# EAGLE design hbridge (EAGLE 5.10)
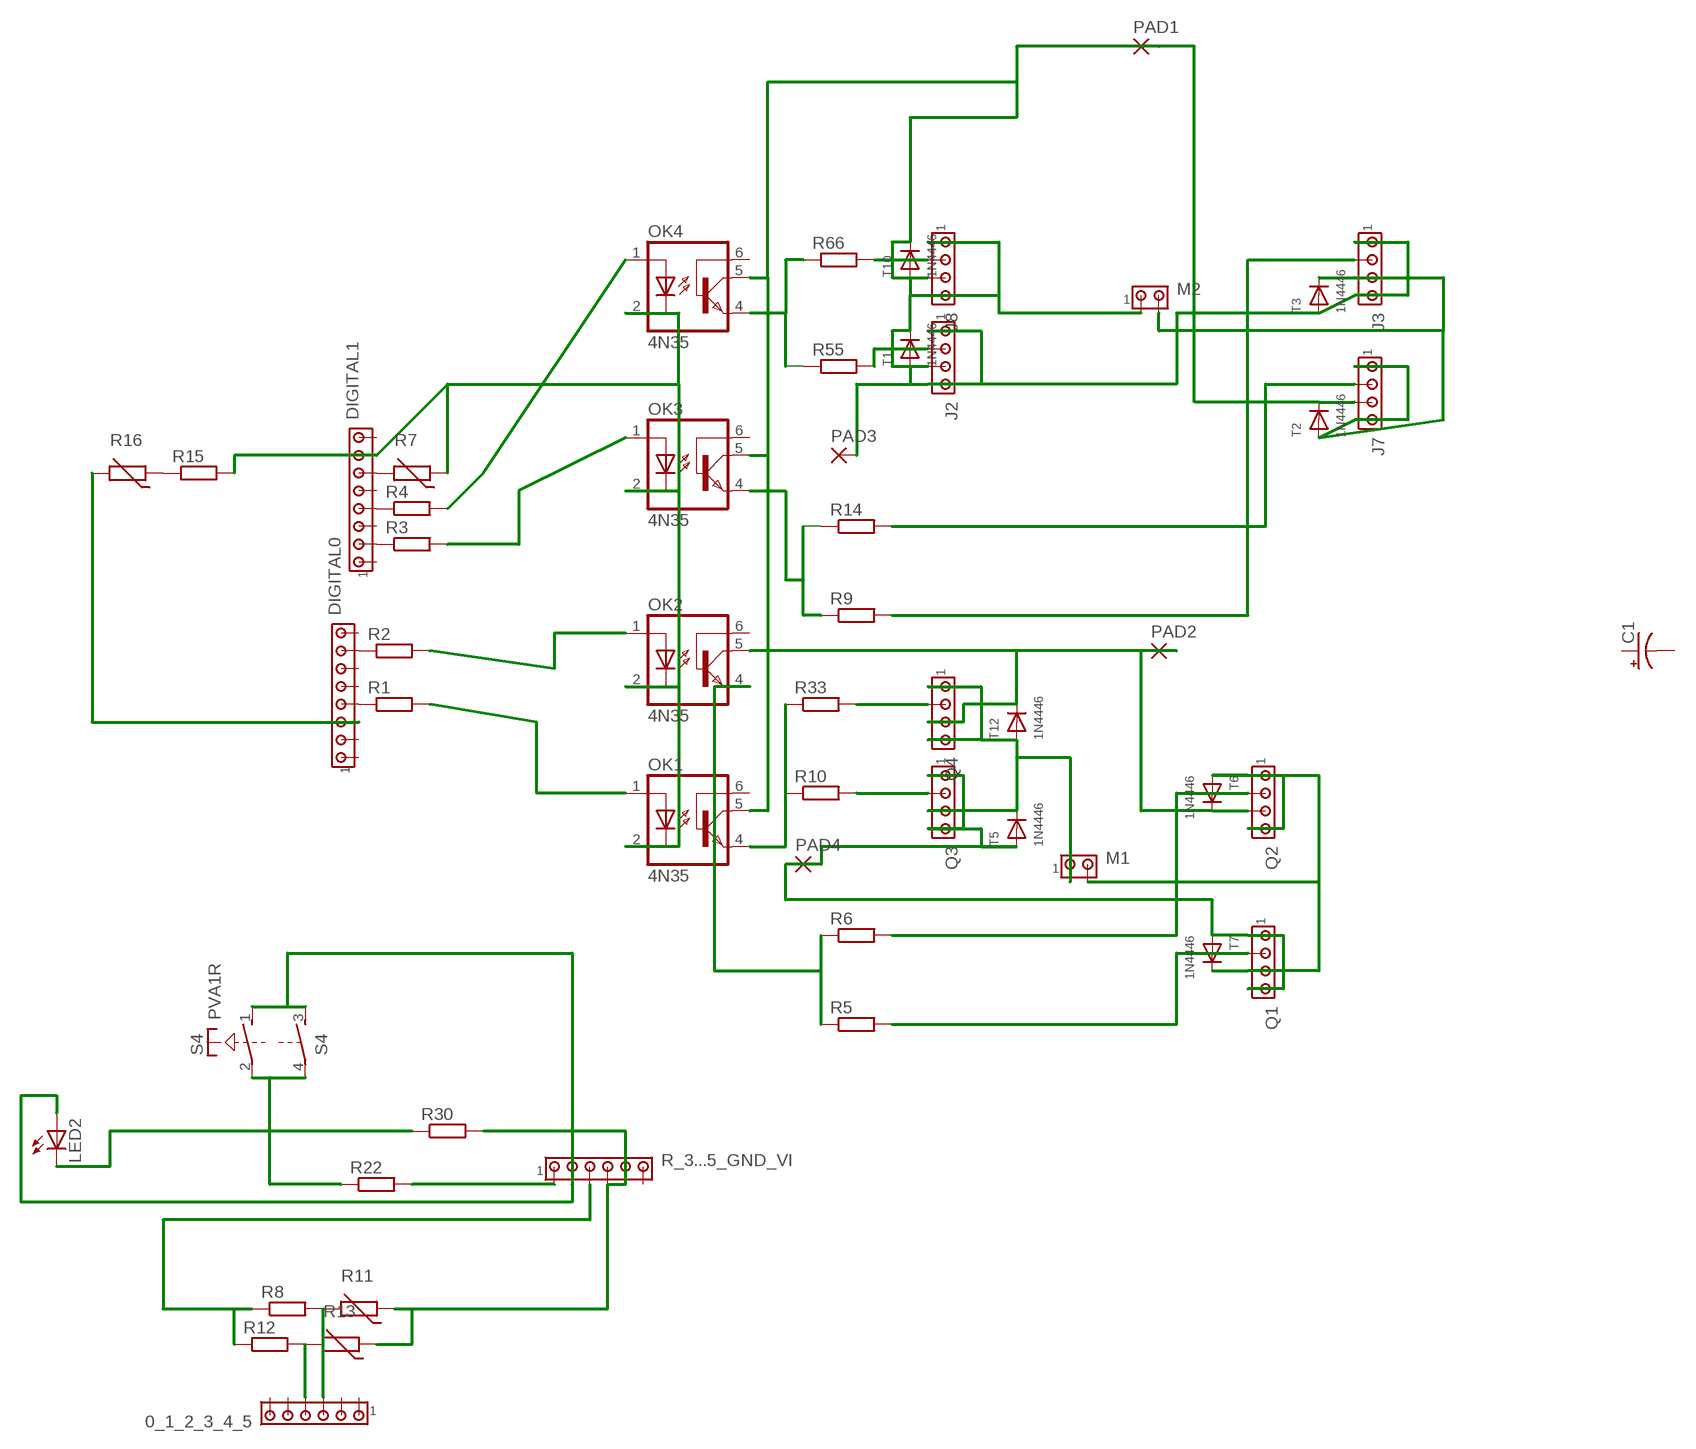
[diagram p0: schematic, sheet 1]

## Parts
0_1_2_3_4_5  MTA06-100  [10X06MTA]
C1  CPOL-USE5-6  [E5-6]
DIGITAL0  MTA08-100  [10X08MTA]
DIGITAL1  MTA08-100  [10X08MTA]
J2  MTA04-100  [10X04MTA]
J3  MTA04-100  [10X04MTA]
J7  MTA04-100  [10X04MTA]
J8  MTA04-100  [10X04MTA]
LED2  LED3MM  [LED3MM]
M1  MTA02-156  [1X2MTA]
M2  MTA02-156  [1X2MTA]
OK1  4N35  [DIL06]
OK2  4N35  [DIL06]
OK3  4N35  [DIL06]
OK4  4N35  [DIL06]
PAD1  2,54/0,8  [2,54/0,8]
PAD2  2,54/0,8  [2,54/0,8]
PAD3  2,54/0,8  [2,54/0,8]
PAD4  2,54/0,8  [2,54/0,8]
Q1  MTA04-100  [10X04MTA]
Q2  MTA04-100  [10X04MTA]
Q3  MTA04-100  [10X04MTA]
Q4  MTA04-100  [10X04MTA]
R1  R-EU_0207/7  [0207/7]
R2  R-EU_0207/7  [0207/7]
R3  R-EU_0207/7  [0207/7]
R4  R-EU_0207/7  [0207/7]
R5  R-EU_0207/7  [0207/7]
R6  R-EU_0207/7  [0207/7]
R7  THERMISTOR-2,5  [RS-2,5]
R8  R-EU_0207/7  [0207/7]
R9  R-EU_0207/7  [0207/7]
R10  R-EU_0207/7  [0207/7]
R11  THERMISTOR-2,5  [RS-2,5]
R12  R-EU_0207/7  [0207/7]
R13  THERMISTOR-2,5  [RS-2,5]
R14  R-EU_0207/7  [0207/7]
R15  R-EU_0207/7  [0207/7]
R16  THERMISTOR-2,5  [RS-2,5]
R22  R-EU_0207/7  [0207/7]
R30  R-EU_0207/7  [0207/7]
R33  R-EU_0207/7  [0207/7]
R55  R-EU_0207/7  [0207/7]
R66  R-EU_0207/7  [0207/7]
R_3...5_GND_VI  MTA06-100  [10X06MTA]
S4  PVA1R  [PVA1R]
T1  1N4446  DIODEDO-1N4148  [DO-1N4148]
T2  1N4446  DIODEDO-1N4148  [DO-1N4148]
T3  1N4446  DIODEDO-1N4148  [DO-1N4148]
T5  1N4446  DIODEDO-1N4148  [DO-1N4148]
T6  1N4446  DIODEDO-1N4148  [DO-1N4148]
T7  1N4446  DIODEDO-1N4148  [DO-1N4148]
T10  1N4446  DIODEDO-1N4148  [DO-1N4148]
T12  1N4446  DIODEDO-1N4148  [DO-1N4148]

## Nets
APWD: R8.1 R12.1 R_3...5_GND_VI.4
N$1: LED2.K(C) R30.1
N$3: 0_1_2_3_4_5.4 R8.2 R11.2
N$4: R15.1 R16.1
N$5: DIGITAL1.7 OK1.2(C) OK2.2(C) OK3.2(C) OK4.2(C) R7.1 R15.2
N$6: OK3.1(A) R3.2
N$7: OK4.1(A) R4.2
N$8: OK2.4(EMI) R5.1 R6.1
N$9: OK2.1(A) R2.2
N$10: R22.1 S4.2(1:P) S4.4(2:P)
N$11: DIGITAL0.4 R1.1
N$12: OK1.1(A) R1.2
N$13: J3.2 R9.2
N$14: OK1.4(EMI) R10.1 R33.1
N$15: DIGITAL0.7 R2.1
N$16: DIGITAL1.2 R3.1
N$17: DIGITAL1.4 R4.1
N$18: J8.2 R66.2
N$19: DIGITAL1.6 R7.2
N$20: J2.3 J8.1 J8.4 M2.1 T1.C T10.A
N$21: PAD4.1(P) Q1.1 Q1.4 Q3.1 Q3.4 T5.A T7.A
N$22: OK3.4(EMI) R9.1 R14.1
N$23: R22.2 R_3...5_GND_VI.6
N$24: OK4.4(EMI) R55.1 R66.1
N$25: J2.2 R55.2
N$26: 0_1_2_3_4_5.3 R12.2 R13.2
N$27: M1.2 Q1.3 Q2.1 Q2.4 T6.A T7.C
N$28: DIGITAL0.3 R16.2
N$29: J7.2 R14.2
N$31: Q2.2 R6.2
N$32: Q3.2 R10.2
N$33: R11.1 R13.1 R30.2 R_3...5_GND_VI.2 R_3...5_GND_VI.3
N$34: M1.1 Q3.3 Q4.1 Q4.4 T5.C T12.A
N$35: Q1.2 R5.2
N$36: Q4.2 R33.2
N$37: J2.1 J2.4 J3.1 J3.4 PAD3.1(P) T1.A T3.A
N$39: J7.3 J8.3 OK1.5(COL) OK2.5(COL) OK3.5(COL) OK4.5(COL) PAD1.1(P) PAD2.1(P) Q2.3 Q4.3 T2.C T6.C T10.C T12.C
N$41: J3.3 J7.1 J7.4 M2.2 T2.A T3.C
N$72: LED2.A R_3...5_GND_VI.5 S4.1(1:S) S4.3(2:S)
Unconnected: 0_1_2_3_4_5.1 0_1_2_3_4_5.2 0_1_2_3_4_5.5 0_1_2_3_4_5.6 C1.+ C1.- DIGITAL0.1 DIGITAL0.2 DIGITAL0.5 DIGITAL0.6 DIGITAL0.8 DIGITAL1.1 DIGITAL1.3 DIGITAL1.5 DIGITAL1.8 OK1.6(BAS) OK2.6(BAS) OK3.6(BAS) OK4.6(BAS) R_3...5_GND_VI.1

## Library data of the parts
0_1_2_3_4_5 R_3...5_GND_VI = con-amp:MTA06-100: AMP connector
C1 = rcl:CPOL-US: POLARIZED CAPACITOR, American symbol
DIGITAL0 DIGITAL1 = con-amp:MTA08-100: AMP connector
J2 J3 J7 J8 Q1-Q4 = con-amp:MTA04-100: AMP connector
LED2 = adafruit:LED: LED OSRAM: - CHIPLED LG R971, LG N971, LY N971, LG Q971, LY Q971, LO R971, LY R971 LH N974, LH R974 LS Q976, LO Q976, LY Q976 LO Q996 - Hyper CHIPLED LW Q18S LB Q993, LB Q99A, LB R99A - SideLED LS A670, LO A670, LY A670, LG A670, LP A670 LB A673, LV A673, LT A673, LW A673 LH A674 LY A675 LS A676, LA A676, LO A676, LY A676, LW A676 LS A679, LY A679, LG A679 - Hyper Micro SIDELED® LS Y876, LA Y876, LO Y876, LY Y876 LT Y87S - SmartLED LW L88C, LW L88S LB L89C, LB L89S, LG L890 LS L89K, LO L89K, LY L89K LS L896, LA L896, LO L896, LY L896 - TOPLED LS T670, LO T670, LY T670, LG T670, LP T670 LSG T670, LSP T670, LSY T670, LOP T670, LYG T670 LG T671, LOG T671, LSG T671 LB T673, LV T673, LT T673, LW T673 LH T674 LS T676, LA T676, LO T676, LY T676, LB T676, LH T676, LSB T676, LW T676 LB T67C, LV T67C, LT T67C, LS T67K, LO T67K, LY T67K, LW E67C LS E67B, LA E67B, LO E67B, LY E67B, LB E67C, LV E67C, LT E67C LW T67C LS T679, LY T679, LG T679 LS T770, LO T770, LY T770, LG T770, LP T770 LB T773, LV T773, LT T773, LW T773 LH T774 LS E675, LA E675, LY E675, LS T675 LS T776, LA T776, LO T776, LY T776, LB T776 LHGB T686 LT T68C, LB T68C - Hyper Mini TOPLED® LB M676 - Mini TOPLED Santana® LG M470 LS M47K, LO M47K, LY M47K Source: http://www.osram.convergy.de/
M1 M2 = con-amp:MTA02-156: AMP connector
OK1-OK4 = optocouplerxxx:4N35: MOTOROLA OPTO COUPLER
PAD1-PAD4 = wirepad:2,54/0,8: THROUGH-HOLE PAD
R1-R6 R8-R10 R12 R14 R15 R22 R30 R33 R55 R66 = resistor:R-EU_: RESISTOR, European symbol
R7 R11 R13 R16 = varistor:THERMISTOR: THERMISTOR
S4 = switch-misc:PVA1R: ITT SWITCH
T1-T3 T5-T7 T10 T12 = adafruit:DIODE: Diode SMADIODE - SMA Surface Mount Package 20V 1A Schottky Diode Digikey: 641-1014-6-ND DO-1N4148 - Through Hole Small Current Diode SOD-123 20V 1 A (.5mV Vf) Schottky Diode - Digikey: MBRX120TPMSCT-ND SOD-323 10V 570mA (.38mV Vf, 3ns) Schottky Diode - Digikey: ZLLS410CT-ND SOD-523 30V 30mA Schottky Diode (RB751S-40TE61) - Digikey: RB751S-40TE61CT-ND SOT23-R/W - SOT23 Package (R = Solder Paste/Reflow Ovens, W = Hand-Soldering) BAT54Film 40V 300mA - Digikey: 497-7162-1-ND

## Board
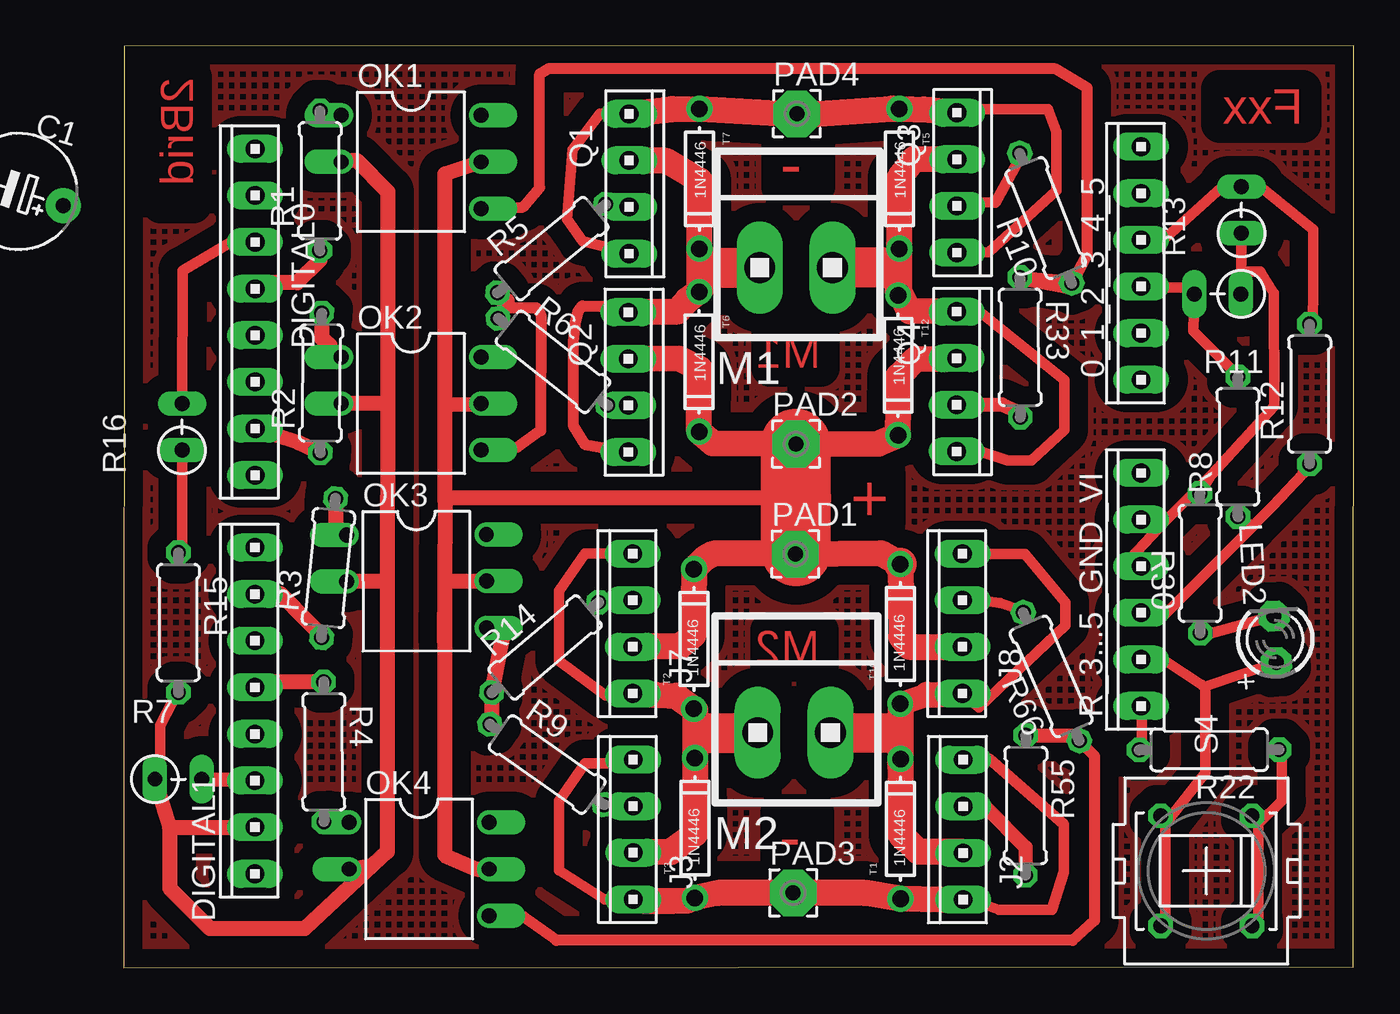
[diagram p1: board, top side]

Size 67.01 x 50.23 mm. Coordinates in mm from the lower left corner, seen from the top.
Outline: 67.01,50.23 0.03,50.21 0,0 66.99,0.05 67.01,50.23
Copper layers (1*16): Top 0.035mm / dielectric 1.5mm / Bottom 0.035mm
Design rules "default *": minimum track width 23mil, minimum drill 24mil, track to track 40mil, track to pad 35mil, pad to pad 28mil, via to via 35mil, smd to smd 25mil, copper to edge 40mil, drill to drill 8mil, minimum pad ring 10mil, minimum via ring 30mil, stop-mask expansion 20mil, vias tented up to drill 0mil, thermal gap 1mil

### Footprints (pad centres in the part's own frame; a part is rotated, then mirrored left to right if it is on the bottom)
10X06MTA = drill 1.016 long: 1 6.35,0; 2 3.81,0; 3 1.27,0; 4 -1.27,0; 5 -3.81,0; 6 -6.35,0
E5-6 = drill 0.813 pad 1.905 round: + -2.54,0 | drill 0.813 pad 1.905 octagon: - 2.54,0
10X08MTA = drill 1.016 long: 1 8.89,0; 2 6.35,0; 3 3.81,0; 4 1.27,0; 5 -1.27,0; 6 -3.81,0; 7 -6.35,0; 8 -8.89,0
10X04MTA = drill 1.016 long: 1 3.81,0; 2 1.27,0; 3 -1.27,0; 4 -3.81,0
LED3MM = drill 0.813 pad 1.676 octagon: A -1.27,0; K 1.27,0
1X2MTA = drill 1.676 long: 1 1.981,0; 2 -1.981,0
DIL06 = drill 0.813 offset: 1 -2.54,-3.81; 2 0,-3.81; 4 2.54,3.81; 5 0,3.81; 6 -2.54,3.81
2,54/0,8 = drill 0.813 pad 2.54 octagon: 1 0,0
0207/7 = drill 0.813 octagon: 1 -3.81,0; 2 3.81,0
RS-2,5 = drill 0.813 long: 1 -1.27,0; 2 1.27,0
PVA1R = drill 0.813 octagon: 1 -2.997,2.489; 2 -2.997,-2.489; 3 2.997,2.489; 4 2.997,-2.489
DO-1N4148 = drill 0.9 round: A -3.81,0; C 3.81,0

### Placement (x,y rotation side)
0_1_2_3_4_5  55.44,38.39 90 top
C1  -5.7,42.29 162.6 top  (outside the outline)
DIGITAL0  7.17,35.73 90 top
DIGITAL1  7.16,14.01 90 top
J2  45.74,7.53 90 top
J3  27.76,7.54 90 top
J7  27.74,18.76 90 top
J8  45.7,18.76 90 top
LED2  62.74,17.9 93.1 top
M1  36.64,38.15 0 top
M2  36.53,12.81 0 top
OK1  15.66,43.91 270 top
OK2  15.66,30.74 270 top
OK3  15.96,21.06 270.1 top
OK4  16.1,5.38 270 top
PAD1  36.6,22.54 0 top
PAD2  36.63,28.54 0 top
PAD3  36.48,4.08 0 top
PAD4  36.68,46.53 0 top
Q1  27.54,42.72 270 top
Q2  27.5,31.91 270 top
Q3  45.4,42.78 270 top
Q4  45.39,31.94 270 top
R1  10.7,42.88 89.9 top
R2  10.76,31.86 89.4 top
R3  11.17,21.78 84.3 top
R4  10.91,11.77 270.1 top
R5  23.32,39.19 39.3 top
R6  23.39,33.02 321.6 top
R7  2.98,10.28 0 top
R8  60.71,28.39 90 top
R9  23.07,11.08 324.9 top
R10  50.24,40.84 111.8 top
R11  59.6,36.71 180 top
R12  64.61,31.26 90 top
R13  60.9,41.29 90 top
R14  22.97,17.46 40.2 top
R15  2.99,18.81 270 top
R16  3.19,29.47 90 top
R22  59.14,11.88 180.1 top
R30  58.65,22.04 90.1 top
R33  48.84,33.81 270.2 top
R55  49.14,8.85 269.9 top
R66  50.54,15.87 113.6 top
R_3...5_GND_VI  55.44,20.61 90 top
S4  58.99,5.28 90 top
T1  42.33,7.57 90 top
T2  31.07,17.92 90 top
T3  31.13,7.62 90 top
T5  42.26,42.99 270 top
T6  31.36,33.02 270 top
T7  31.37,42.99 270 top
T10  42.31,18.19 90 top
T12  42.2,32.83 270 top

### Tracks (layer width: path | path; a pad name or v marks a point on that pad's centre or on a via)
APWD
  Top 0.584: 60.56,23.08 56.75,19.27 55.48,19.27 R_3...5_GND_VI.4 | 60.56,23.08 61.5,24.04 60.73,24.6 R8.1 | 60.56,23.08 62.58,25.14 64.67,27.37 64.25,26.98 R12.1
N$1
  Top 0.584: R30.1 58.68,18.21 59.01,18.16 LED2.K
N$2
  pour Top (hatched): 0.18,50.04 66.89,50.1 66.89,0.34 0.24,0.41
N$3
  Top 0.584: 0_1_2_3_4_5.4 55.48,37.05 56.75,37.05 57.01,37.06 58.31,37.06 R11.2 58.28,34.7 60.59,32.38 R8.2
N$4
  Top 0.584: R15.1 3.2,23.09 3.2,28.16 R16.1
N$5
  Top 0.584: R15.2 2.98,15.1 2.01,13.22 2.01,10.28 R7.1
  Top 0.813: DIGITAL1.7 2.51,7.66 R7.1 2.54,7.63 2.54,4.31 4.72,2.13 9.88,2.13 13.56,5.59 OK4.2 12.41,5.26 13.21,5.26 14.36,6.31 14.36,20.83 | OK3.2 14.34,21.06 14.36,20.83 | 14.37,30.73 OK2.2 | 14.38,30.72 14.37,30.73 | 14.38,30.72 14.36,20.83 | OK1.2 12.7,43.99 14.39,42.3 14.38,30.72 | 14.38,30.72 14.38,30.69 14.37,30.73
N$6
  Top 0.813: R3.2 11.55,24.14 OK3.1
N$7
  Top 0.813: OK4.1 10.96,7.92 R4.2
N$8
  Top 0.61: OK2.4 21.44,28.36 22.73,29.27 22.74,35.57 22.48,35.96 21.13,35.96 R5.1
  Top 0.813: 20.92,36.33 R5.1 20.92,36.3 R6.1
N$9
  Top 0.813: R2.2 10.78,34.31 11.24,33.94 11.08,33.61 OK2.1
N$10
  Top 0.584: 61.83,7.84 61.83,2.76 S4.2 | 61.83,7.84 63.1,9.11 63.1,11.65 R22.1 | 61.83,7.84 S4.4
N$11
  Top 0.813: R1.1 10.69,38.54 9.47,37.32 7.49,37.32 DIGITAL0.4
N$12
  Top 0.813: R1.2 11.8,46.49 OK1.1
N$13
  Top 0.813: R9.2 26.7,8.84 26.64,8.72 27.54,8.72 J3.2
N$14
  Top 0.61: OK1.4 21.76,41.45 22.67,42.51 22.67,48.69 23.2,49.01 50.7,49.01 52.49,47.95 52.49,38.85 R10.1
  Top 0.762: R33.1 51.67,37.05 48.92,37.59 R10.1
N$15
  Top 0.813: DIGITAL0.7 9.52,28.61 R2.1
N$16
  Top 0.813: R3.1 10.79,18.12 9.27,19.64 9.27,19.67 8.57,20.37 DIGITAL1.2
N$17
  Top 0.813: R4.1 7.46,15.58 DIGITAL1.4
N$18
  Top 0.584: R66.2 49.02,19.45 47.75,19.88 46.92,20 J8.2
N$19
  Top 0.762: R7.2 4.64,10.24 5.94,10.24 DIGITAL1.6
N$20
  Top 0.584: J8.1 46.55,22.56 49.09,22.56 51.3,19.92 51.3,18.65 46.59,14.19 J8.4
  Top 1.27: 43.78,14.88 T10.A
  Top 1.422: 43.78,14.88 J8.4 | T10.A 42.31,12.75 | 42.31,12.75 42.31,10.97 T1.C 42.33,7.25 42.68,6.9 42.72,6.9 43.28,6.34 45.66,6.34 J2.3 | 42.31,12.75 41.88,12.77
  Top 2.184: 41.88,12.77 M2.1
N$21
  Top 0.584: Q1.1 26.2,39.3 25,39.59 24.16,40.78 24.46,44.58 25.96,46.53 Q1.4 | 45.3,39.32 Q3.1 47.13,38.98 50.83,42.35 50.83,45.56 50.36,46.78 45.36,46.78 Q3.4 | 42.14,46.8 40.59,46.89 37.06,46.48 | 43.94,46.74 43.59,46.77
  Top 1.422: Q1.4 29.88,46.79 T7.A 37.06,46.48 | 37.06,46.48 36.43,46.68 PAD4.1 37.06,46.48 | 37.06,46.48 41.86,46.82 T5.A | 42.14,46.8 43.94,46.74 | 43.59,46.77 Q3.4
N$22
  Top 0.813: OK3.4 20.74,18.52 R14.1 20.06,13.46 R9.1
N$23
  Top 0.584: 55.48,11.65 55.48,14.19
  Top 0.762: R22.2 55.48,11.65 | 55.48,14.19 R_3...5_GND_VI.6
N$24
  Top 0.61: OK4.4 21.74,2.82 23.58,1.49 51.71,1.49 52.9,2.57 52.9,11.54 R66.1
  Top 0.762: R66.1 51.83,12.5 51.89,12.66 R55.1
N$25
  Top 0.762: R55.2 49.16,4.97 49.13,6.57 46.96,8.77 J2.2
N$26
  Top 0.584: 0_1_2_3_4_5.3 55.51,39.77 56.78,39.77 59.82,42.54 R13.2 61.92,42.56 64.8,40.23 64.8,36.42 64.76,35.12 R12.2
N$27
  Top 0.61: Q2.1 25.13,28.52 24.49,29.56 24.49,34.12 24.59,35.08 24.78,35.8 24.98,36.06 27.15,36.06 Q2.4
  Top 1.422: Q1.3 27.32,43.97 29.54,43.97 31.39,42.89 T7.C 31.38,36.88 | 31.45,36.96 31.38,36.88 | 31.45,36.96 T6.A | 31.38,36.88 32.15,38.15 | 31.45,36.96 30.71,36.39 30.18,35.76 27.51,35.76 Q2.4
  Top 2.184: 32.15,38.15 M1.2
N$28
  Top 0.584: R16.2 3.22,37.99 5.95,39.59 DIGITAL0.3
N$29
  Top 0.813: R14.2 26.55,20.01 J7.2
N$31
  Top 0.813: R6.2 26.72,30.6 Q2.2
N$32
  Top 0.584: R10.2 49.13,44.67 47.49,41.7 45.4,41.75 Q3.2
N$33
  Top 0.584: 56.75,24.35 54.47,21.9 R_3...5_GND_VI.3 | 56.75,24.35 59.29,26.89 | 59.29,26.89 62.68,30.62 62.65,36.75 61.93,37.93 60.88,37.93 R11.1 60.89,38.08 60.89,39.99 R13.1 | 59.29,26.89 R30.2 | 56.75,24.35 55.48,24.35 R_3...5_GND_VI.2
N$34
  Top 0.584: Q4.1 45.32,28.16 46.59,28.16 48.19,27.63 49.46,27.63 51.24,29.31 51.24,32.03 46.59,35.78 45.32,35.78 Q4.4
  Top 1.422: Q3.3 45.2,44.08 43.08,44.07 42.27,43.05 T5.C 42.26,37.18 | 42.17,36.96 42.26,37.18 | 42.17,36.96 T12.A | 42.26,37.18 41.36,38.16 | 42.17,36.96 42.21,36.96 42.82,35.77 44.75,35.76 Q4.4
  Top 2.184: 41.36,38.16 M1.1
N$35
  Top 0.813: R5.2 26.48,41.44 Q1.2
N$36
  Top 0.762: R33.2 48.89,30.23 47.86,30.7 45.32,30.7 Q4.2
N$37
  Top 0.584: 45.32,4.03 45.67,3.69 | J3.1 27.68,11.13 25.14,11.13 23.73,9.11 23.73,5.3 26.2,3.72 27.47,3.72 J3.4 | 45.32,4.03 47.7,3.15 50.58,3.17 51.23,5.22 51.22,7.82 47.16,11.38 J2.1 | 45.32,4.03 J2.4
  Top 1.422: T1.A | T1.A 40.38,4.08 PAD3.1 32.38,4.08 T3.A 30.71,3.66 29.88,3.63 28.4,3.63 J3.4 | 45.67,3.69 T1.A
N$39
  Top 0.813: OK1.5 19.73,43.99 17.51,43.26 17.51,30.71 | 17.51,30.71 19.87,30.7 OK2.5 | 36.64,25.59 17.87,25.6 17.75,25.6 17.51,25.46 | PAD1.1 36.64,22.7 | OK4.5 19.25,5.38 17.5,6.13 17.5,17.69 | 17.5,17.69 17.5,20.72 17.51,25.46 | OK3.5 17.52,21.08 17.5,17.69 | 17.51,25.46 17.51,30.71
  Top 1.422: Q4.3 44.84,33.17 43.18,33.19 42.24,32.25 T12.C 41.1,28.56 PAD2.1 32.11,28.57 T6.C 31.39,32.63 30.27,33.19 27.57,33.17 Q2.3 | PAD1.1 41.26,22.59 T10.C | 36.36,22.57 32.15,22.57 31.64,22.3 T2.C 31.03,18.12 30.32,17.52 27.76,17.52 J7.3 | J8.3 42.81,17.49 42.37,18.03 42.33,21.98
  Top 1.778: PAD1.1 36.36,22.57 | T10.C 42.33,21.98
  Top 3.81: 36.64,25.59 36.64,22.7 PAD2.1
N$41
  Top 0.584: 27.18,14.9 26.27,14.84 23.73,16.73 23.73,20.54 25.13,22.57 J7.1
  Top 1.422: J3.3 27.93,6.28 29.81,6.31 31.15,7.3 T3.C 31.14,12.68 | 31.14,12.68 31.14,14.04 T2.A 30.1,14.82 J7.4 27.18,14.9 | 31.14,12.68 31.6,12.81
  Top 2.184: 31.6,12.81 M2.2
N$72
  Top 0.584: 56.75,7.84 56.75,2.76 S4.1 | 58.92,15.34 58.73,15.42 56.75,16.73 55.48,16.73 R_3...5_GND_VI.5 | 56.75,7.84 58.92,10.61 58.92,15.34 | 56.75,7.84 S4.3 | 58.92,15.34 LED2.A

### Text on the board
Top: 2Brid | Fxx | - | M1 | + | M2 | -